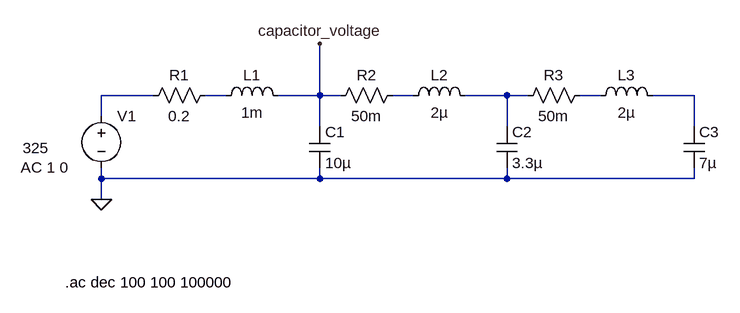
[diagram p0: schematic grid_inverter_ac_sweep.asc]
grid_inverter_ac_sweep.asc, the LTspice schematic file:
Version 4
SHEET 1 880 680
WIRE -16 128 -96 128
WIRE 96 128 64 128
WIRE 240 128 240 48
WIRE 240 128 176 128
WIRE 272 128 240 128
WIRE 384 128 352 128
WIRE 528 128 464 128
WIRE 560 128 528 128
WIRE 672 128 640 128
WIRE 816 128 752 128
WIRE -96 160 -96 128
WIRE 240 176 240 128
WIRE 528 176 528 128
WIRE 816 176 816 128
WIRE -96 256 -96 240
WIRE 240 256 240 240
WIRE 240 256 -96 256
WIRE 528 256 528 240
WIRE 528 256 240 256
WIRE 816 256 816 240
WIRE 816 256 528 256
WIRE -96 288 -96 256
FLAG -96 288 0
FLAG 240 48 capacitor_voltage
SYMBOL ind 80 144 R270
WINDOW 0 32 56 VTop 2
WINDOW 3 5 56 VBottom 2
SYMATTR InstName L1
SYMATTR Value 1m
SYMBOL cap 224 176 R0
SYMATTR InstName C1
SYMATTR Value 10µ
SYMBOL res 80 112 R90
WINDOW 0 0 56 VBottom 2
WINDOW 3 32 56 VTop 2
SYMATTR InstName R1
SYMATTR Value 0.2
SYMBOL voltage -96 144 R0
WINDOW 123 -124 95 Left 2
WINDOW 39 0 0 Left 0
WINDOW 3 -121 65 Left 2
SYMATTR Value2 AC 1 0
SYMATTR InstName V1
SYMATTR Value 325
SYMBOL ind 368 144 R270
WINDOW 0 32 56 VTop 2
WINDOW 3 5 56 VBottom 2
SYMATTR InstName L2
SYMATTR Value 2µ
SYMBOL cap 512 176 R0
SYMATTR InstName C2
SYMATTR Value 3.3µ
SYMBOL res 368 112 R90
WINDOW 0 0 56 VBottom 2
WINDOW 3 32 56 VTop 2
SYMATTR InstName R2
SYMATTR Value 50m
SYMBOL ind 656 144 R270
WINDOW 0 32 56 VTop 2
WINDOW 3 5 56 VBottom 2
SYMATTR InstName L3
SYMATTR Value 2µ
SYMBOL cap 800 176 R0
SYMATTR InstName C3
SYMATTR Value 7µ
SYMBOL res 656 112 R90
WINDOW 0 0 56 VBottom 2
WINDOW 3 32 56 VTop 2
SYMATTR InstName R3
SYMATTR Value 50m
TEXT -152 416 Left 2 !.ac dec 100 100 100000

The netlist it stands for:
* grid_inverter_ac_sweep.asc
L1 N002 capacitor_voltage 1m
C1 capacitor_voltage 0 10µ
R1 N002 N001 0.2
V1 N001 0 325 AC 1 0
L2 N003 N004 2µ
C2 N004 0 3.3µ
R2 N003 capacitor_voltage 50m
L3 N005 N006 2µ
C3 N006 0 7µ
R3 N005 N004 50m
.ac dec 100 100 100000
.backanno
.end